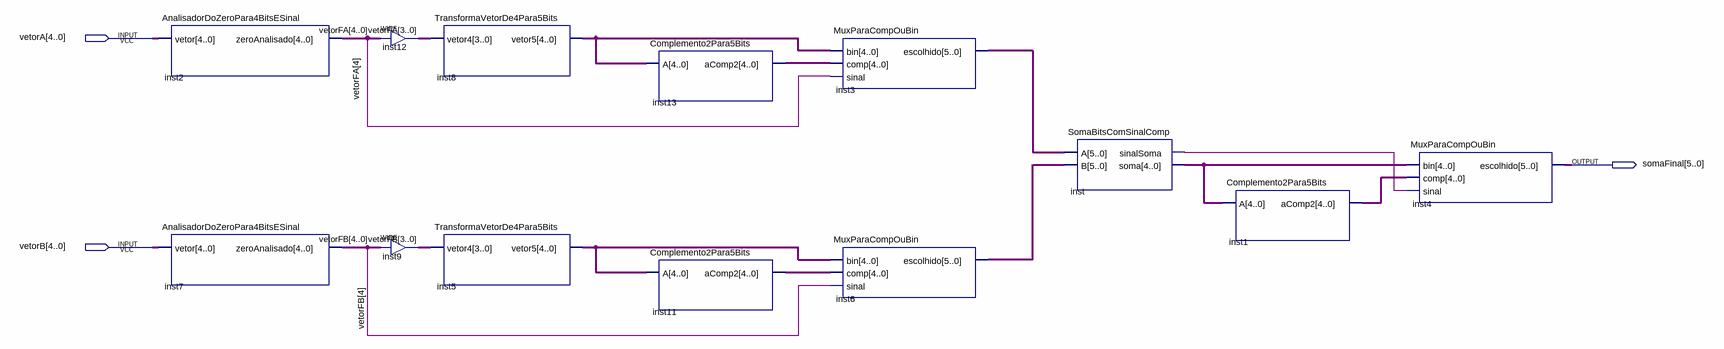
[diagram p0: schematic sheet]
// Quartus schematic SomadorCompleto.bdf as structural Verilog: 13 symbols, 3 pins
module SomadorCompleto (
  input  [4:0] vetorA,
  input  [4:0] vetorB,
  output [5:0] somaFinal
);

  wire inst_sinalsoma;
  wire [3:0] inst9_out, inst12_out;
  wire [4:0] inst1_acomp2, inst5_vetor5, inst8_vetor5, inst11_acomp2, inst13_acomp2, inst_soma, vetorFA,
       vetorFB;
  wire [5:0] inst3_escolhido, inst6_escolhido;

  AnalisadorDoZeroPara4BitsESinal inst2 (.vetor(vetorA), .zeroAnalisado(vetorFA));
  AnalisadorDoZeroPara4BitsESinal inst7 (.vetor(vetorB), .zeroAnalisado(vetorFB));
  assign inst12_out = vetorFA[3:0];  // WIRE inst12
  assign inst9_out = vetorFB[3:0];  // WIRE inst9
  TransformaVetorDe4Para5Bits inst8 (.vetor4(inst12_out), .vetor5(inst8_vetor5));
  TransformaVetorDe4Para5Bits inst5 (.vetor4(inst9_out), .vetor5(inst5_vetor5));
  Complemento2Para5Bits inst13 (.A(inst8_vetor5), .aComp2(inst13_acomp2));
  Complemento2Para5Bits inst11 (.A(inst5_vetor5), .aComp2(inst11_acomp2));
  MuxParaCompOuBin inst3 (.bin(inst8_vetor5), .comp(inst13_acomp2), .sinal(vetorFA[4]), .escolhido(inst3_escolhido));
  MuxParaCompOuBin inst6 (.bin(inst5_vetor5), .comp(inst11_acomp2), .sinal(vetorFB[4]), .escolhido(inst6_escolhido));
  SomaBitsComSinalComp inst (.A(inst3_escolhido), .B(inst6_escolhido), .sinalSoma(inst_sinalsoma), .soma(inst_soma));
  Complemento2Para5Bits inst1 (.A(inst_soma), .aComp2(inst1_acomp2));
  MuxParaCompOuBin inst4 (.bin(inst_soma), .comp(inst1_acomp2), .sinal(inst_sinalsoma), .escolhido(somaFinal));
endmodule
